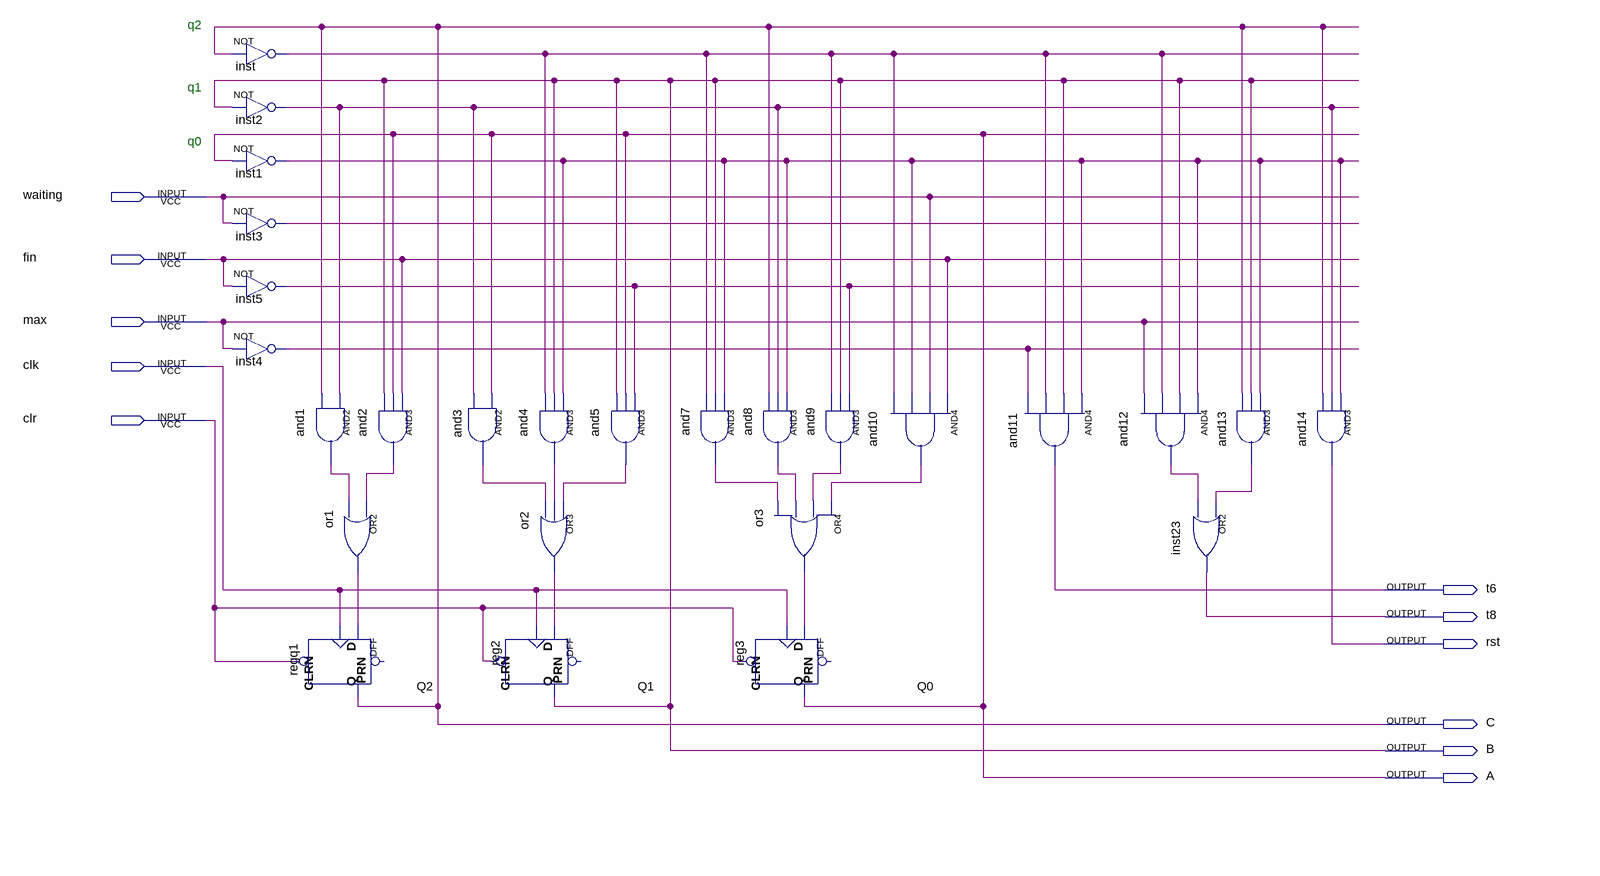
[diagram p0: schematic sheet]
// Quartus schematic TLC.bdf as structural Verilog: 26 symbols, 11 pins
module TLC (
  input  waiting,
  input  fin,
  input  max,
  input  clk,
  input  clr,
  output t6,
  output t8,
  output rst,
  output C,
  output B,
  output A
);

  wire and1_out, and2_out, and3_out, and4_out, and5_out, and7_out, and8_out, and9_out, and10_out, and12_out,
       and13_out, inst1_out, inst2_out, inst3_out, inst4_out, inst5_out, inst_out, or1_out, or2_out, or3_out;

  not inst (inst_out, C);
  not inst2 (inst2_out, B);
  not inst1 (inst1_out, A);
  not inst3 (inst3_out, waiting);
  not inst5 (inst5_out, fin);
  not inst4 (inst4_out, max);
  and and1 (and1_out, inst2_out, C);
  DFF regq1 (.CLRN(clr), .CLK(clk), .D(or1_out), .Q(C));  // open: PRN
  and and2 (and2_out, fin, A, B);
  or or1 (or1_out, and2_out, and1_out);
  and and3 (and3_out, A, inst2_out);
  DFF reg2 (.CLRN(clr), .CLK(clk), .D(or2_out), .Q(B));  // open: PRN
  and and4 (and4_out, inst1_out, B, inst_out);
  or or2 (or2_out, and5_out, and4_out, and3_out);
  and and5 (and5_out, inst5_out, A, B);
  and and7 (and7_out, inst1_out, B, inst_out);
  and and8 (and8_out, inst1_out, inst2_out, C);
  or or3 (or3_out, and10_out, and9_out, and8_out, and7_out);
  DFF reg3 (.CLRN(clr), .CLK(clk), .D(or3_out), .Q(A));  // open: PRN
  and and9 (and9_out, inst5_out, B, inst_out);
  and and10 (and10_out, fin, waiting, inst1_out, inst_out);
  and and11 (t6, inst1_out, B, inst_out, inst4_out);
  and and12 (and12_out, inst1_out, B, inst_out, max);
  and and13 (and13_out, inst1_out, B, C);
  or inst23 (t8, and13_out, and12_out);
  and and14 (rst, inst1_out, inst2_out, C);

  // Other names for the same wires on the sheet: Q0 = A; Q1 = B; Q2 = C

  // Notes on the sheet:
  //   q2
  //   q1
  //   q0
endmodule
